# Altium schematic sheet 2_MCU.schdoc
size 292 x 219 mm
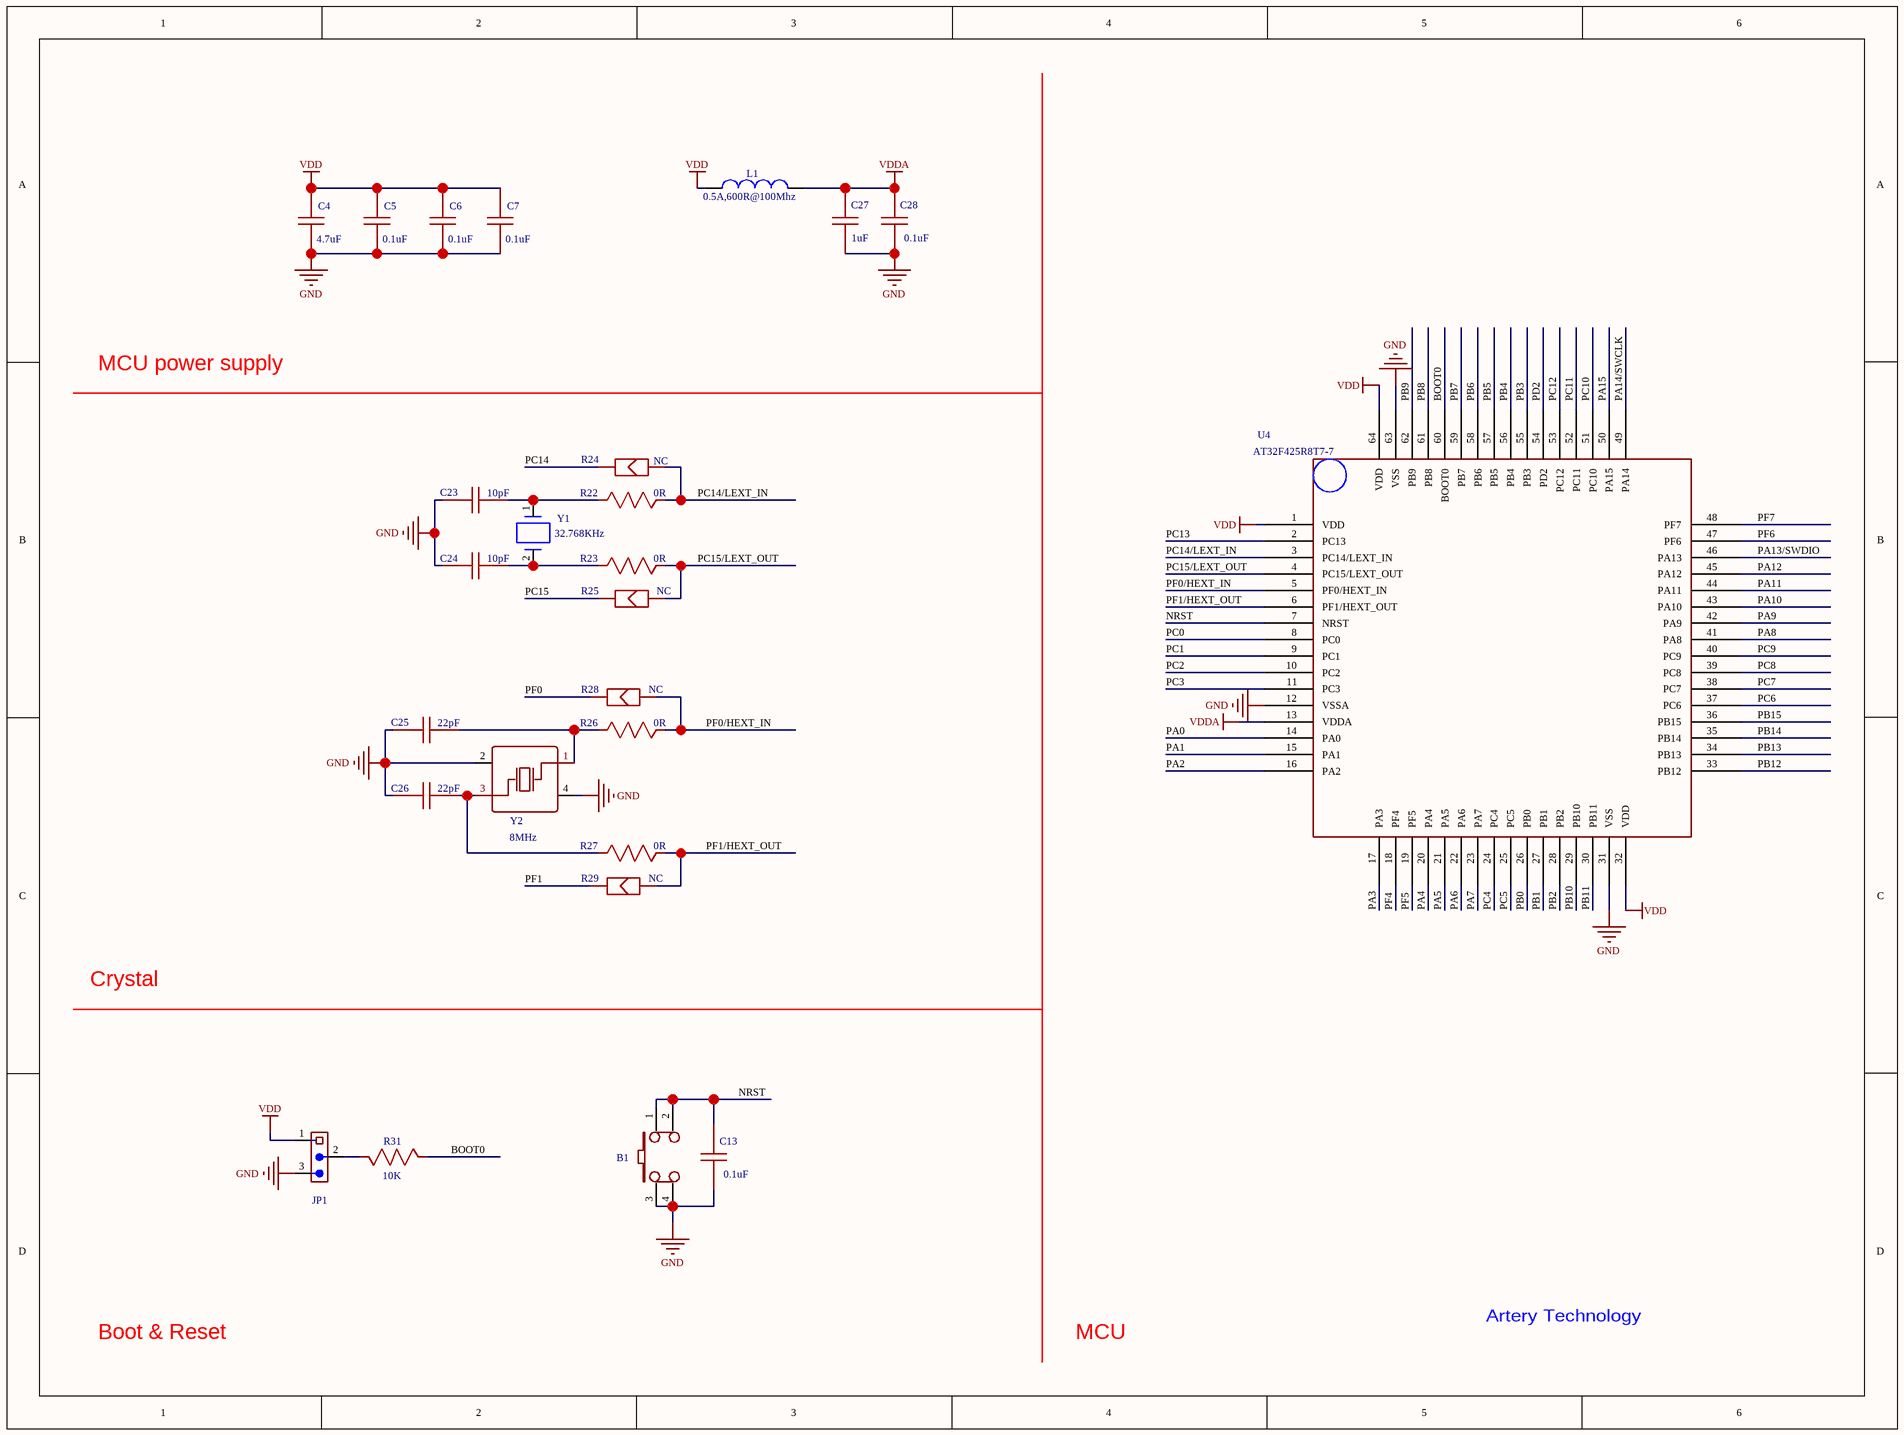
[diagram p0: 2_MCU.schdoc]

## Parts
B1  BUTTON_SMT,6.0x6.0x4.5mm  [BUTTON_SMT_6*6*5]  (value not drawn)
C4  4.7uF  [0603_C-M]
C5  0.1uF  [0603_C-M]
C6  0.1uF  [0603_C-M]
C7  0.1uF  [0603_C-M]
C13  0.1uF  [0603_C-M]
C23  10pF  [0603_C-M]
C24  10pF  [0603_C-M]
C25  22pF  [0603_C-M]
C26  22pF  [0603_C-M]
C27  1uF  [0603_C-M]
C28  0.1uF  [0603_C-M]
JP1  Header 1x3  [HEADER 1X3]  (value not drawn)
L1  0.5A,600R@100Mhz  [0603_L]
R22  0R  [0603_R-M]
R23  0R  [0603_R-M]
R24  NC  [SB-PAD]
R25  NC  [SB-PAD]
R26  0R  [0603_R-M]
R27  0R  [0603_R-M]
R28  NC  [SB-PAD]
R29  NC  [SB-PAD]
R31  10K  [0603_R-M]
U4  AT32F425R8T7-7  [IC_LQFP64_7X7]
Y1  32.768KHz  [XTAL_SOP - FC-12M]
Y2  8MHz  [OSC-SMD_4P-L5.0-W3.2-BL]

## Nets
GND: B1.3 B1.4 C4.2 C5.2 C6.2 C7.2 C13.1 C23.1 C24.1 C25.1 C26.1 C27.1 C28.1 JP1.3 U4.12(VSSA) U4.31(VSS) U4.63(VSS) Y2.2(GND) Y2.4(GND)
VDD: C4.1 C5.1 C6.1 C7.1 JP1.1 L1.1 U4.1(VDD) U4.32(VDD) U4.64(VDD)
VDDA: C27.2 C28.2 L1.2 U4.13(VDDA)
BOOT0: R31.2 U4.60(BOOT0)
NRST: B1.1 B1.2 C13.2 U4.7(NRST)
PA0: U4.14(PA0)
PA1: U4.15(PA1)
PA2: U4.16(PA2)
PA3: U4.17(PA3)
PA4: U4.20(PA4)
PA5: U4.21(PA5)
PA6: U4.22(PA6)
PA7: U4.23(PA7)
PA8: U4.41(PA8)
PA9: U4.42(PA9)
PA10: U4.43(PA10)
PA11: U4.44(PA11)
PA12: U4.45(PA12)
PA13/SWDIO: U4.46(PA13)
PA14/SWCLK: U4.49(PA14)
PA15: U4.50(PA15)
PB0: U4.26(PB0)
PB1: U4.27(PB1)
PB2: U4.28(PB2)
PB3: U4.55(PB3)
PB4: U4.56(PB4)
PB5: U4.57(PB5)
PB6: U4.58(PB6)
PB7: U4.59(PB7)
PB8: U4.61(PB8)
PB9: U4.62(PB9)
PB10: U4.29(PB10)
PB11: U4.30(PB11)
PB12: U4.33(PB12)
PB13: U4.34(PB13)
PB14: U4.35(PB14)
PB15: U4.36(PB15)
PC0: U4.8(PC0)
PC1: U4.9(PC1)
PC2: U4.10(PC2)
PC3: U4.11(PC3)
PC4: U4.24(PC4)
PC5: U4.25(PC5)
PC6: U4.37(PC6)
PC7: U4.38(PC7)
PC8: U4.39(PC8)
PC9: U4.40(PC9)
PC10: U4.51(PC10)
PC11: U4.52(PC11)
PC12: U4.53(PC12)
PC13: U4.2(PC13)
PC14: R24.2
PC14/LEXT_IN: R22.1 R24.1 U4.3(PC14/LEXT_IN)
PC15: R25.2
PC15/LEXT_OUT: R23.1 R25.1 U4.4(PC15/LEXT_OUT)
PD2: U4.54(PD2)
PF0: R28.2
PF0/HEXT_IN: R26.1 R28.1 U4.5(PF0/HEXT_IN)
PF1: R29.2
PF1/HEXT_OUT: R27.1 R29.1 U4.6(PF1/HEXT_OUT)
PF4: U4.18(PF4)
PF5: U4.19(PF5)
PF6: U4.47(PF6)
PF7: U4.48(PF7)
NetC23_2: C23.2 R22.2 Y1.1
NetC24_2: C24.2 R23.2 Y1.2
NetC25_2: C25.2 R26.2 Y2.1(OSC1)
NetC26_2: C26.2 R27.2 Y2.3(OSC2)
NetJP1_2: JP1.2 R31.1

## Notes on the sheet
- MCU power supply
- Crystal
- Boot & Reset
- MCU
- Artery Technology

## Library data of the parts
B1 = BUTTON_SMT,6.0x6.0x4.5mm: Contributor: twb17; spicePre: S; spiceSymbolName: Button,SMD_4P
C4 = 4.7uF: nameAlias: Value(F); Contributor: LCEDA_Lib; spicePre: C; spiceSymbolName: C_0603_US
C5-C7 C13 C28 = 0.1uF: nameAlias: Value(F); Contributor: LCEDA_Lib; spicePre: C; spiceSymbolName: C_0603_US
C23 C24 = 10pF: nameAlias: Value(F); Contributor: LCEDA_Lib; spicePre: C; spiceSymbolName: C_0603_US
C25 C26 = 22pF: nameAlias: Value(F); Contributor: LCEDA_Lib; spicePre: C; spiceSymbolName: C_0603_US
C27 = 1uF: nameAlias: Value(F); Contributor: LCEDA_Lib; spicePre: C; spiceSymbolName: C_0603_US
L1 = 0.5A,600R@100Mhz: Contributor: twb17; spicePre: L; spiceSymbolName: Bead_0603
R22 R23 R26 R27 = 0R: nameAlias: Value(Ω); Contributor: LCEDA_Lib; spicePre: R; spiceSymbolName: R_0603_US
R24 R25 R28 R29 = NC: Contributor: twb17; spicePre: R; spiceSymbolName: Solder bridge
R31 = 10K: nameAlias: Value(Ω); Contributor: LCEDA_Lib; spicePre: R; spiceSymbolName: R_0603_US
U4 = AT32F425R8T7-7: Contributor: twb17; Package Display: No; spicePre: U; spiceSymbolName: AT32F425RxT7
Y1 = 32.768KHz: Contributor: twb17; spicePre: Y; spiceSymbolName: 32.768KHz,CRY,30PPM,Size_3X8
Y2 = 8MHz: BOM_Manufacturer: YXC; BOM_Manufacturer Part: X50328MSD4SC; nameAlias: Frequency; BOM_Paste Type: recommend; BOM_Supplier: LCSC; BOM_Supplier Part: C16422; spicePre: X; spiceSymbolName: X50328MSD4SC